# Altium schematic sheet KEYPAD.SchDoc
size A4
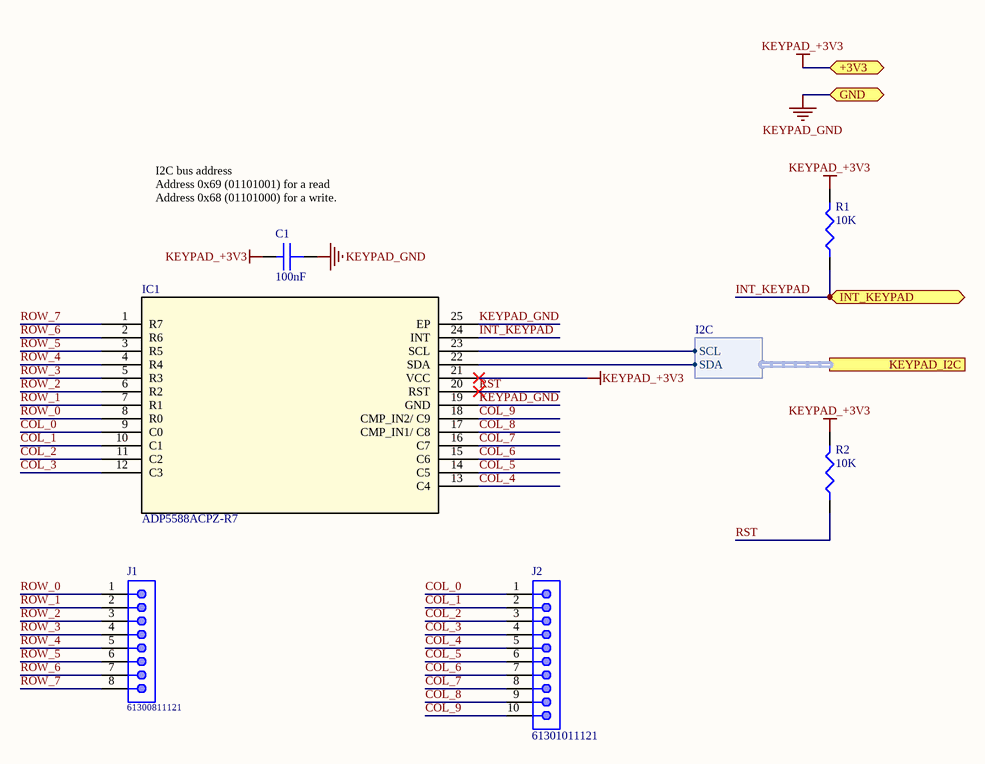
[diagram p0: KEYPAD.SchDoc]

## Parts
C1  100nF  [C0603]
IC1  ADP5588ACPZ-R7  [CP_24_1]
J1  61300811121  [61300811121]
J2  61301011121  [61301011121]
R1  10K  [R0603]
R2  10K  [R0603]

## Ports
+3V3 (bidir), GND (bidir), INT_KEYPAD (bidir), KEYPAD_I2C (harness I2C)

## Harnesses
I2C: SCL, SDA

## Nets
KEYPAD_+3V3: C1.1 IC1.21(VCC) R1.2 R2.2 ; port +3V3
KEYPAD_GND: C1.2 IC1.19(GND) IC1.25(EP) ; port GND
COL_0: IC1.9(C0) J2.1
COL_1: IC1.10(C1) J2.2
COL_2: IC1.11(C2) J2.3
COL_3: IC1.12(C3) J2.4
COL_4: IC1.13(C4) J2.5
COL_5: IC1.14(C5) J2.6
COL_6: IC1.15(C6) J2.7
COL_7: IC1.16(C7) J2.8
COL_8: IC1.17(CMP_IN1/_C8) J2.9
COL_9: IC1.18(CMP_IN2/_C9) J2.10
INT_KEYPAD: IC1.24(INT) R1.1 ; port INT_KEYPAD
ROW_0: IC1.8(R0) J1.1
ROW_1: IC1.7(R1) J1.2
ROW_2: IC1.6(R2) J1.3
ROW_3: IC1.5(R3) J1.4
ROW_4: IC1.4(R4) J1.5
ROW_5: IC1.3(R5) J1.6
ROW_6: IC1.2(R6) J1.7
ROW_7: IC1.1(R7) J1.8
RST: IC1.20(RST) R2.1
NetIC1_22: IC1.22(SDA) ; port KEYPAD_I2C.SDA
NetIC1_23: IC1.23(SCL) ; port KEYPAD_I2C.SCL

## Notes on the sheet
- (near C1) I2C bus address
  Address 0x69 (01101001) for a read
  Address 0x68 (01101000) for a write.
- Tarih/Date
- Haz/Prep
- Kont/Check
- Onay/Appr
- Sayfa/Sht
- Form
- Ortam/Env
- /
- Deg Tarihi/Chng Date
- Deg Onay/Chng Appr
- Rev
- All rights reserved. No part of this document may be reproduced or transmitted in any form or by any means, electronic, mechanical, photocopying, recording, or otherwise, without prior written permission of

## Library data of the parts
C1 = CC0603KRX7R8BB104: 100nF, 25V, X7R, 10%, 0603; Manufacturer: Yageo; Supplier 1: Digi-Key; Supplier Part Number 1: 311-1341-1-ND; Manufacturer Part Number: CC0603KRX7R8BB104; Stock 1: 10150433; Pricing 1: 1 = 0,10000, 10 = 0,04500, 50 = 0,02480, 100 = 0,02020, 500 = 0,01444, 1000 = 0,01134 (USD); RoHS: Yes; Mount: Surface Mount; Case/Package: 0603; Number of Pins: 2; Case Code (Imperial): 0603; Case Code (Metric): 1608; Min Operating Temperature: -55°C; Max Operating Temperature: 125°C; Capacitance: 100nF; Tolerance: 10%; Voltage Rating: 25V; Packaging: Tape and Reel; Package Quantity: 1; Voltage Rating (DC): 25V; Dielectric: X7R; Termination: SMD/SMT; Resistor Type: Ceramic; Voltage: 25V; Length: 1.6mm; Width: 0.8mm; Height: 0.8mm; Thickness: 0.035inch; Depth: 0.8mm; Radiation Hardening: No; REACH SVHC: Unknown; Lead Free: Lead Free; Halogen Free: Halogen Free; ComponentLink1URL: https://datasheet.ciiva.com/11786/0900766b80c10176-11786120.pdf?src-supplier=RSComponents; ComponentLink1Description: https://datasheet.ciiva.com/11786/0900766b80c10176-11786120.pdf?src-supplier=RSComponents; ComponentLink2URL: https://datasheet.ciiva.com/144/mlccorderingcode-144075.pdf?src-supplier=Digi-Key; ComponentLink2Description: https://datasheet.ciiva.com/144/mlccorderingcode-144075.pdf?src-supplier=Digi-Key; ComponentLink3URL: https://datasheet.ciiva.com/17434/upy-gphc-x7r-6-3v-to-50v-8-17434263.pdf?src-supplier=Avnet+Europe; ComponentLink3Description: https://datasheet.ciiva.com/17434/upy-gphc-x7r-6-3v-to-50v-8-17434263.pdf?src-supplier=Avnet+Europe; ComponentLink4URL: https://datasheet.ciiva.com/26829/getdatasheetpartid-403577-26829431.pdf?src-supplier=Verical; ComponentLink4Description: https://datasheet.ciiva.com/26829/getdatasheetpartid-403577-26829431.pdf?src-supplier=Verical; ComponentLink5URL: https://datasheet.ciiva.com/11587/upy-gphc-x7r-6-3v-to-50v-8-11587208.pdf?src-supplier=Avnet; ComponentLink5Description: https://datasheet.ciiva.com/11587/upy-gphc-x7r-6-3v-to-50v-8-11587208.pdf?src-supplier=Avnet; ComponentLink6URL: https://datasheet.ciiva.com/13389/upy-gphc-x7r-6-3v-to-50v-8-13389352.pdf?src-supplier=Mouser; ComponentLink6Description: https://datasheet.ciiva.com/13389/upy-gphc-x7r-6-3v-to-50v-8-13389352.pdf?src-supplier=Mouser; ComponentLink7URL: https://datasheet.ciiva.com/28450/1489800-28450584.pdf?src-supplier=Element14; ComponentLink7Description: https://datasheet.ciiva.com/28450/1489800-28450584.pdf?src-supplier=Element14; ComponentLink8URL: https://datasheet.ciiva.com/144/mlccorderingcode-144073.pdf?src-supplier=Digi-Key; ComponentLink8Description: https://datasheet.ciiva.com/144/mlccorderingcode-144073.pdf?src-supplier=Digi-Key; ComponentLink9URL: https://datasheet.ciiva.com/144/mlccorderingcode-144074.pdf?src-supplier=Digi-Key; ComponentLink9Description: https://datasheet.ciiva.com/144/mlccorderingcode-144074.pdf?src-supplier=Digi-Key; ComponentLink10URL: https://datasheet.ciiva.com/7978/1489800-7978155.pdf?src-supplier=Element14; ComponentLink10Description: https://datasheet.ciiva.com/7978/1489800-7978155.pdf?src-supplier=Element14; Category: Capasitor
IC1 = ADP5588ACPZ-R7: IC KEYPAD SCANNER GPIO PORT EXP; Manufacturer: Analog Devices; Interface: I2C; Number of I/Os: 18; Min Supply Voltage: 1.7V; Max Supply Voltage: 3V; Max Frequency: 400kHz; Nominal Supply Current: 200uA; Supplier 1: Digi-Key; Manufacturer Part Number: ADP5588ACPZ-R7; Stock 1: 100; Pricing 1: 1 = 2,78000, 10 = 2,50000, 25 = 2,36400, 100 = 1,94360, 250 = 1,74400, 500 = 1,68096 (USD); RoHS: Yes; Mount: Surface Mount; Case/Package: LFCSP EP; Number of Pins: 24; Contact Plating: Tin,Matte; Min Operating Temperature: -40°C; Max Operating Temperature: 85°C; Packaging: Tape and Reel; Package Quantity: 1500; Frequency: 400kHz; REACH SVHC: No SVHC; Lead Free: Contains Lead; ComponentLink1URL: https://datasheet.ciiva.com/1784/adp5588-1784128.pdf?src-supplier=Digi-Key; ComponentLink1Description: https://datasheet.ciiva.com/1784/adp5588-1784128.pdf?src-supplier=Digi-Key; ComponentLink2URL: https://datasheet.ciiva.com/1784/adp5588-1784129.pdf?src-supplier=Digi-Key; ComponentLink2Description: https://datasheet.ciiva.com/1784/adp5588-1784129.pdf?src-supplier=Digi-Key; ComponentLink3URL: https://datasheet.ciiva.com/3245/adp5588-3245397.pdf?src-supplier=Avnet; ComponentLink3Description: https://datasheet.ciiva.com/3245/adp5588-3245397.pdf?src-supplier=Avnet; ComponentLink4URL: https://datasheet.ciiva.com/48708/001248645-da-01-en-ic-keypad-sca-adp5588acpz-r7-vqfn-24-adi-48708620.pdf?src-supplier=Conrad; ComponentLink4Description: https://datasheet.ciiva.com/48708/001248645-da-01-en-ic-keypad-sca-adp5588acpz-r7-vqfn-24-adi-48708620.pdf?src-supplier=Conrad; Supplier Part Number 1: ADP5588ACPZ-R7DKR-ND; Category: Integrated Circuits - Interface - Specialized
J1 = 61300811121: WR-PHD Pin Header, THT, pitch 2.54mm, Single Row, Vertical, 8pin; Manufacturer: Wurth Electronics; Pin Number: 8; Gender: Male; Rated Current: 3A; Working Voltage: 250VAC; Withstanding Voltage: 500VAC; Contact Resistance: 20mOhm; Connector Type: Male Pin; ComponentLink1Description: Manufacturer; ComponentLink1URL: http://www.we-online.de; ComponentLink2Description: Datasheet; ComponentLink2URL: https://katalog.we-online.de/em/datasheet/6130xx11121.pdf; Part Number: 61300811121; Published Date: June 2019; Publisher: Wurth Elektronik; Pitch: 2.54mm; Operating Temperature: -40 to +105degC; Mounting Technology: THT; Packaging: Bag; Row Number: Single; Orientation: Vertical; Supplier 1: Digi-Key; Manufacturer Part Number: 61300811121; Stock 1: 15970; Pricing 1: 1 = 0,37000, 10 = 0,31500, 25 = 0,26320, 50 = 0,21900, 100 = 0,19900, 1000 = 0,18100 (USD); RoHS: Yes; Mount: Through Hole; Contact Plating: Gold; Contact Material: Copper; Color: Black; Number of Rows: 1; Number of Positions: 8; Termination: Solder; Number of Contacts: 8; Contact Mating Length: 0.236inch; REACH SVHC: Unknown; ComponentLink3URL: http://www.farnell.com/cad/1737268.pdf?src-supplier=Element14; ComponentLink3Description: http://www.farnell.com/cad/1737268.pdf?src-supplier=Element14; ComponentLink4URL: https://katalog.we-online.de/em/datasheet/6130xx11121.pdf?src-supplier=Digi-Key; ComponentLink4Description: https://katalog.we-online.de/em/datasheet/6130xx11121.pdf?src-supplier=Digi-Key; Category: Connectors, Interconnects Rectangular Connectors; Supplier Part Number 1: 732-5321-ND
J2 = 61301011121: WURTH ELEKTRONIK - 61301011121 - Pin Header, Board-to-Board, 2.54 mm, 1 Rows, 10 Contacts, Through Hole, WR-PHD Series; Manufacturer: Wurth Electronics; Current Rating: 3A; Number of Positions: 10; Insulation Resistance: 1GR; Voltage Rating: 250V; Gender: Male; Connector Type: Male Pin; Pitch: 2.54mm; Supplier 1: Digi-Key; Supplier Part Number 1: 732-2670-ND; Manufacturer Part Number: 61301011121; Stock 1: 2673; Pricing 1: 1 = 0,89000, 10 = 0,87400, 50 = 0,80600, 100 = 0,73900, 200 = 0,67200 (USD); RoHS: Yes; Mount: Through Hole; Contact Plating: Gold; Contact Material: Copper Alloy,Copper; Color: Black; Housing Material: PBT; Min Operating Temperature: -40°C; Max Operating Temperature: 125°C; Package Quantity: 1000; Packaging: Bulk; Termination: Solder; Number of Contacts: 10; Number of Rows: 1; Contact Gender: Male; Orientation: Straight; Length: 2.54mm; Width: 25.4mm; Height: 11.54mm; Contact Mating Length: 0.236inch; REACH SVHC: Unknown; Flammability Rating: UL94 V-0; ComponentLink1URL: https://datasheet.ciiva.com/738/6130xx11121-738550.pdf?src-supplier=Digi-Key; ComponentLink1Description: https://datasheet.ciiva.com/738/6130xx11121-738550.pdf?src-supplier=Digi-Key; ComponentLink2URL: https://datasheet.ciiva.com/7631/1442175-7631321.pdf?src-supplier=Element14; ComponentLink2Description: https://datasheet.ciiva.com/7631/1442175-7631321.pdf?src-supplier=Element14; ComponentLink3URL: https://datasheet.ciiva.com/48700/001088187-da-01-en-wr-phd-tht-stiftleiste-61301011121-48700876.pdf?src-supplier=Conrad; ComponentLink3Description: https://datasheet.ciiva.com/48700/001088187-da-01-en-wr-phd-tht-stiftleiste-61301011121-48700876.pdf?src-supplier=Conrad; Category: Connectors, Interconnects Rectangular Connectors
R1 R2 = RT0603FRE0710KL: 10K OHM 1% 1/10W 0603; Manufacturer: Yageo; Resistance: 10kR; Power Rating: 100mW; Voltage Rating: 75V; Temperature Coefficient: 50ppm/°C; Supplier 1: Digi-Key; Supplier Part Number 1: YAG2321CT-ND; Manufacturer Part Number: RT0603FRE0710KL; Stock 1: 326134; Pricing 1: 1 = 0,10000, 10 = 0,05600, 100 = 0,02270, 1000 = 0,01020, 2500 = 0,00886 (USD); RoHS: Yes; Case/Package: 0603; Number of Pins: 2; Case Code (Metric): 1608; Case Code (Imperial): 0603; Contact Plating: Tin,Lead; Min Operating Temperature: -55°C; Max Operating Temperature: 125°C; Package Quantity: 5000; Packaging: Tape and Reel; Tolerance: 1%; Resistor Type: Thin Film; Number of Terminations: 2; Termination: SMD/SMT; Max Power Dissipation: 100mW; Voltage Rating (DC): 75V; Features: Moisture Resistant; Length: 0.063inch; Width: 0.031inch; Height: 0.022inch; Depth: 0.8mm; REACH SVHC: Unknown; Military Standard: Not; Lead Free: Lead Free; ComponentLink1URL: https://datasheet.ciiva.com/2559/pyu-rt-1-to-0-05-rohs-l-5-2559482.pdf?src-supplier=Digi-Key; ComponentLink1Description: https://datasheet.ciiva.com/2559/pyu-rt-1-to-0-05-rohs-l-5-2559482.pdf?src-supplier=Digi-Key; ComponentLink2URL: https://datasheet.ciiva.com/16745/pyu-rt-1-to-0-05-rohs-l-4-16745739.pdf?src-supplier=Future+Electronics; ComponentLink2Description: https://datasheet.ciiva.com/16745/pyu-rt-1-to-0-05-rohs-l-4-16745739.pdf?src-supplier=Future+Electronics; ComponentLink3URL: https://datasheet.ciiva.com/12694/pyu-rt-1-to-0-05-rohs-l-4-12694910.pdf?src-supplier=Mouser; ComponentLink3Description: https://datasheet.ciiva.com/12694/pyu-rt-1-to-0-05-rohs-l-4-12694910.pdf?src-supplier=Mouser; Category: Resistor